# Altium project LevelSensor.PrjPcb
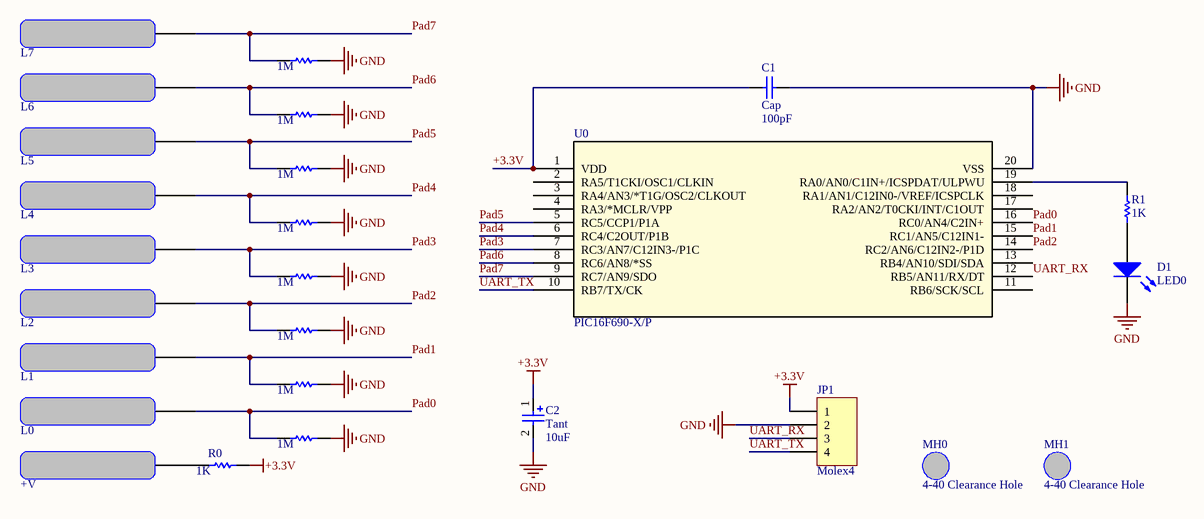
[diagram p0: PIC16F690Sensor.SchDoc]
1 sheet, 26 parts. Net scope: global (net labels, ports and power ports of the same name join across sheets).
Board file: LevelSensor.PcbDoc

## Sheet PIC16F690Sensor.SchDoc
size A

### Parts
+V  Water Pad  [WaterPad]  (value not drawn)
C1  Cap  value 100pF  [RAD-0.1]
C2  Tant  value 10uF  [10UF_TANTALUM NO CROSS]
D1  LED0  [DIODE_SMALL]
JP1  Molex4  [MOLEX_4_PIN]
L0  Water Pad  [WaterPad]  (value not drawn)
L1  Water Pad  [WaterPad]  (value not drawn)
L2  Water Pad  [WaterPad]  (value not drawn)
L3  Water Pad  [WaterPad]  (value not drawn)
L4  Water Pad  [WaterPad]  (value not drawn)
L5  Water Pad  [WaterPad]  (value not drawn)
L6  Water Pad  [WaterPad]  (value not drawn)
L7  Water Pad  [WaterPad]  (value not drawn)
MH0  4-40 Clearance Hole  [4-40 Clearance Hole]
MH1  4-40 Clearance Hole  [4-40 Clearance Hole]
R0  value 1K  [Resistor-0.1]  (hidden comment: Res1)
R1  value 1K  [Resistor-0.1]  (hidden comment: Res1)
R2  value 1M  [Resistor-0.1]  (hidden comment: R2)
R3  value 1M  [Resistor-0.1]  (hidden comment: Res1)
R4  value 1M  [Resistor-0.1]  (hidden comment: Res1)
R5  value 1M  [Resistor-0.1]  (hidden comment: Res1)
R6  value 1M  [Resistor-0.1]  (hidden comment: Res1)
R7  value 1M  [Resistor-0.1]  (hidden comment: Res1)
R8  value 1M  [Resistor-0.1]  (hidden comment: Res1)
R9  value 1M  [Resistor-0.1]  (hidden comment: Res1)
U0  PIC16F690-X/P  [DIP-20-KEY]

### Nets
+3.3V: C1.2 C2.1 JP1.1 R0.2 U0.1(VDD)
GND: C1.1 C2.2 D1.2(K) JP1.2 R2.2 R3.2 R4.2 R5.2 R6.2 R7.2 R8.2 R9.2 U0.20(VSS)
Pad0: L0.0 R2.1 U0.16(RC0/AN4/C2IN+)
Pad1: L1.0 R3.1 U0.15(RC1/AN5/C12IN1-)
Pad2: L2.0 R4.1 U0.14(RC2/AN6/C12IN2-/P1D)
Pad3: L3.0 R5.1 U0.7(RC3/AN7/C12IN3-/P1C)
Pad4: L4.0 R6.1 U0.6(RC4/C2OUT/P1B)
Pad5: L5.0 R7.1 U0.5(RC5/CCP1/P1A)
Pad6: L6.0 R8.1 U0.8(RC6/AN8/*SS)
Pad7: L7.0 R9.1 U0.9(RC7/AN9/SDO)
UART_RX: JP1.3 U0.12(RB5/AN11/RX/DT)
UART_TX: JP1.4 U0.10(RB7/TX/CK)
Net+V_0: +V.0 R0.1
NetD1_1: D1.1(A) R1.1
NetR1_2: R1.2 U0.19(RA0/AN0/C1IN+/ICSPDAT/ULPWU)

Not connected (* = marked no-connect by the designer): U0 2(RA5/T1CKI/OSC1/CLKIN) 3(RA4/AN3/*T1G/OSC2/CLKOUT) 4(RA3/*MCLR/VPP) 11(RB6/SCK/SCL) 13(RB4/AN10/SDI/SDA) 17(RA2/AN2/T0CKI/INT/C1OUT) 18(RA1/AN1/C12IN0-/VREF/ICSPCLK)

### Library data of the parts
C1 = Cap: Capacitor; Manufacturer: Generic Components; Class: Passive; Published: 08/06/2000; Publisher: Altium Hobart Technology Centre; SubClass: Capacitor
C2 = Cap Pol1: Polarized Capacitor (Radial); Manufacturer: Generic Components; Class: Passive; Published: 08/06/2000; Publisher: Altium Hobart Technology Centre; SubClass: Capacitor
D1 = LED0: Typical INFRARED GaAs LED; Published: 8-Jun-2000; LatestRevisionDate: 08-Jul-2005; LatestRevisionNote: Mech Layer 1 removed.; PackageReference: LED-0; Publisher: Altium Limited; PackageDescription: LED; 2 Leads
JP1 = Molex4: Header, 4-Pin; Manufacturer: Generic Components; Class: Connector
R0-R9 = Res1: Resistor; Published: 8-Jun-2000; LatestRevisionDate: 17-Jul-2002; LatestRevisionNote: Re-released for DXP Platform.; PackageReference: AXIAL-0.3; Publisher: Altium Limited; PackageDescription: Axial Device, Thru-Hole; 2 Leads; 0.3 in Pin Spacing
U0 = PIC16F690-X/P: Imported; Vendor: Microchip; Built_By: EMA_UL_Team; C: Copyright (C) 2015 Accelerated Designs. All rights reserved; Manufacturer_Part_Number: PIC16F690-X/P; RefDes: RefDes; Type: DEV; Value: Value